# EAGLE design Macro_Watch (EAGLE 7.4.0)
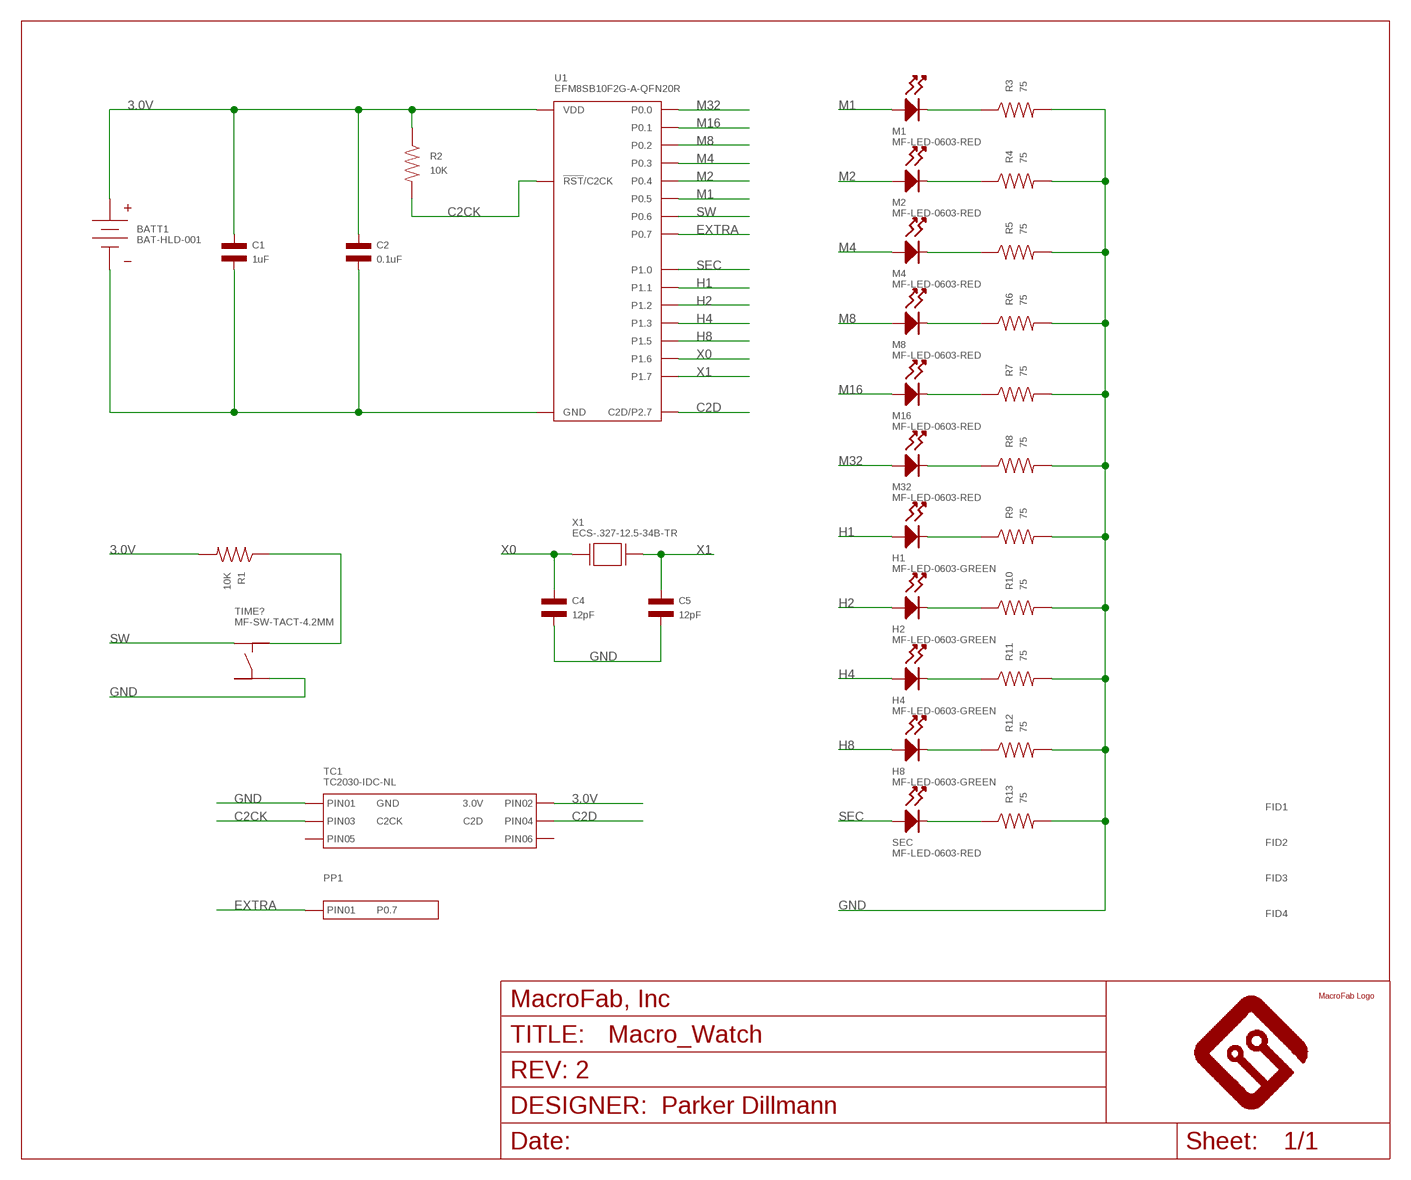
[diagram p0: schematic, sheet 1]

## Parts
BATT1  BAT-HLD-001  BATTERY_BAT-HLD-001  [BAT-HLD-001]
C1  1uF  CAPACITOR_NP_0402  [C0402]
C2  0.1uF  CAPACITOR_NP_0402  [C0402]
C4  12pF  CAPACITOR_NP_0402  [C0402]
C5  12pF  CAPACITOR_NP_0402  [C0402]
FID1  FIDUCIAL_0.5MM  [FIDUCIAL_0.5MM]
FID2  FIDUCIAL_0.5MM  [FIDUCIAL_0.5MM]
FID3  FIDUCIAL_0.5MM  [FIDUCIAL_0.5MM]
FID4  FIDUCIAL_0.5MM  [FIDUCIAL_0.5MM]
FRAME1  MF_FRAMEDEFAULT  [MF_FRAME_DEFAULT]
H1  MF-LED-0603-GREEN  LED_SINGLE-0603-GREEN  [LED0603]
H2  MF-LED-0603-GREEN  LED_SINGLE-0603-GREEN  [LED0603]
H4  MF-LED-0603-GREEN  LED_SINGLE-0603-GREEN  [LED0603]
H8  MF-LED-0603-GREEN  LED_SINGLE-0603-GREEN  [LED0603]
M1  MF-LED-0603-RED  LED_SINGLE-0603-RED  [LED0603]
M2  MF-LED-0603-RED  LED_SINGLE-0603-RED  [LED0603]
M4  MF-LED-0603-RED  LED_SINGLE-0603-RED  [LED0603]
M8  MF-LED-0603-RED  LED_SINGLE-0603-RED  [LED0603]
M16  MF-LED-0603-RED  LED_SINGLE-0603-RED  [LED0603]
M32  MF-LED-0603-RED  LED_SINGLE-0603-RED  [LED0603]
PP1  POGO_PIN_01X01_70-9150  [POGO_PIN_70-9150]
R1  10K  RESISTOR_0402  [R0402]
R2  10K  RESISTOR_0402  [R0402]
R3  75  RESISTOR_0402  [R0402]
R4  75  RESISTOR_0402  [R0402]
R5  75  RESISTOR_0402  [R0402]
R6  75  RESISTOR_0402  [R0402]
R7  75  RESISTOR_0402  [R0402]
R8  75  RESISTOR_0402  [R0402]
R9  75  RESISTOR_0402  [R0402]
R10  75  RESISTOR_0402  [R0402]
R11  75  RESISTOR_0402  [R0402]
R12  75  RESISTOR_0402  [R0402]
R13  75  RESISTOR_0402  [R0402]
SEC  MF-LED-0603-RED  LED_SINGLE-0603-RED  [LED0603]
TC1  TC2030-IDC-NL  CON_02X03_TC2030-IDC-NL  [TC2030-IDC-NL]
TIME?  MF-SW-TACT-4.2MM  TACT_4.2MM  [TACT4.2MM]
U1  EFM8SB10F2G-A-QFN20R  EFM8SB10F(2/4/8)G-A-QFN20  [EFM8SB10F(2/4/8)G-A-QFN20]
U$1  MF_LOGOLOGO_SMALL  [MF_LOGO_SMALL]
X1  ECS-.327-12.5-34B-TR  CYRSTAL_ECX-31B  [ECX-31B_SERIES]

## Nets
3.0V: BATT1.POS_0(POS) BATT1.POS_1(POS) C1.P$1 C2.P$1 R1.P$2 R2.P$1 TC1.P$2(PIN2) U1.P$4(VDD)
C2CK: R2.P$2 TC1.P$3(PIN3) U1.P$5(!RST!/C2CK)
C2D: TC1.P$4(PIN4) U1.P$6(C2D/P2.7)
EXTRA: PP1.P$1(PIN1) U1.P$15(P0.7)
GND: BATT1.NEG_0(NEG) C1.P$2 C2.P$2 C4.P$2 C5.P$2 R3.P$2 R4.P$2 R5.P$2 R6.P$2 R7.P$2 R8.P$2 R9.P$2 R10.P$2 R11.P$2 R12.P$2 R13.P$2 TC1.P$1(PIN1) TIME?.P$4 U1.P$3(GND) U1.P$12(GND) U1.PAD(GND)
H1: H1.ANODE U1.P$13(P1.1)
H2: H2.ANODE U1.P$11(P1.2)
H4: H4.ANODE U1.P$10(P1.3)
H8: H8.ANODE U1.P$9(P1.5)
M1: M1.ANODE U1.P$17(P0.5)
M2: M2.ANODE U1.P$18(P0.4)
M4: M4.ANODE U1.P$19(P0.3)
M8: M8.ANODE U1.P$20(P0.2)
M16: M16.ANODE U1.P$1(P0.1)
M32: M32.ANODE U1.P$2(P0.0)
N$1: R1.P$1 TIME?.P$2
N$6: M1.CATHODE R3.P$1
N$7: M2.CATHODE R4.P$1
N$8: M4.CATHODE R5.P$1
N$9: M8.CATHODE R6.P$1
N$10: M16.CATHODE R7.P$1
N$11: M32.CATHODE R8.P$1
N$12: H1.CATHODE R9.P$1
N$13: H2.CATHODE R10.P$1
N$14: H4.CATHODE R11.P$1
N$15: H8.CATHODE R12.P$1
N$16: R13.P$1 SEC.CATHODE
SEC: SEC.ANODE U1.P$14(P1.0)
SW: TIME?.P$1 U1.P$16(P0.6)
X0: C4.P$1 U1.P$8(P1.6) X1.P$1(X0)
X1: C5.P$1 U1.P$7(P1.7) X1.P$2(X1)
Unconnected: TC1.P$5(PIN5) TC1.P$6(PIN6) TIME?.P$3

## Library data of the parts
BATT1 = MF_Connectors:BATTERY: Library: MF_Connectors Description: Batterys and Battery Connectors.; HOUSEPART: NO; MPN: BAT-HLD-001; POPULATE: 1; URL: http://www.mouser.com/ds/2/238/bat-hld-001-220194.pdf
C1 = MF_Passives:CAPACITOR_NP: Library: MF_Passives Description: Device for Non-Polarized Capacitors. Manufacture part number (MPN) can be added via Attributes. Check https://factory.macrofab.com/parts for the house parts list.; MPN: MF-CAP-0402-1uF; POPULATE: 1
C2 = MF_Passives:CAPACITOR_NP: Library: MF_Passives Description: Device for Non-Polarized Capacitors. Manufacture part number (MPN) can be added via Attributes. Check https://factory.macrofab.com/parts for the house parts list.; MPN: MF-CAP-0402-0.1uF; POPULATE: 1
C4 C5 = MF_Passives:CAPACITOR_NP: Library: MF_Passives Description: Device for Non-Polarized Capacitors. Manufacture part number (MPN) can be added via Attributes. Check https://factory.macrofab.com/parts for the house parts list.; MPN: 500R07S120KV4T; POPULATE: 1
FID1-FID4 = MF_Aesthetics:FIDUCIAL: Library: MF_Aesthetics Description: Fiducial marking for PCB alignment inside PNP and other machines.; HOUSEPART: NO; POPULATE: 0
FRAME1 = MF_Aesthetics:MF_FRAME: Library: MF_Aesthetics Description: Frame for adding Meta Data to the PCB and Schematic.; DNAME: Parker Dillmann; HOUSEPART: 0; POPULATE: 0; REVNUM: REV: 2
H1 H2 H4 H8 = MF_LEDs:LED_SINGLE: Library: MF_LEDs Description: Device for Single LED Packages. Manufacture part number (MFG#) can be added via Attributes.; HOUSEPART: YES; MPN: MF-LED-0603-GREEN; POPULATE: 1; URL: https://factory.macrofab.com/part/MF-LED-0603-GREEN
M1 M2 M4 M8 M16 M32 SEC = MF_LEDs:LED_SINGLE: Library: MF_LEDs Description: Device for Single LED Packages. Manufacture part number (MFG#) can be added via Attributes.; HOUSEPART: YES; MPN: MF-LED-0603-RED; POPULATE: 1; URL: https://factory.macrofab.com/part/MF-LED-0603-RED
PP1 = MF_Connectors:POGO_PIN_01X01: Library: MF_Connectors Description: Pogo Pin Connector; HOUSEPART: NO; LABEL01: P0.7; POPULATE: 0; URL: http://www.avx.com/products/connectors/board-to-board/pogo-pin-single-contact-70-9150/f
R1 R2 = MF_Passives:RESISTOR: Library: MF_Passives Description: Device for Resistors. Manufacture part number (MPN), Voltage, Tolerance, and Wattage Rating can be added via Attributes. Check https://factory.macrofab.com/parts for the house parts list.; MPN: MF-RES-0402-10K; POPULATE: 1
R3-R13 = MF_Passives:RESISTOR: Library: MF_Passives Description: Device for Resistors. Manufacture part number (MPN), Voltage, Tolerance, and Wattage Rating can be added via Attributes. Check https://factory.macrofab.com/parts for the house parts list.; MPN: MF-RES-0402-75; POPULATE: 1
TC1 = MF_Connectors:CON_02X03: Library: MF_Connectors Description: Header Connector with 6 Positions and 02 Rows. Use the LABEL Attribute to label the pin on the schematic and PCB. You can remove the attributes on the PCB by using the SMASH function on the part and then deleting the text.; HOUSEPART: NO; LABEL01: GND; LABEL02: 3.0V; LABEL03: C2CK; LABEL04: C2D; MPN: TC2030-IDC-NL; POPULATE: 0; URL: http://www.tag-connect.com/TC2030-IDC-NL
TIME? = MF_Switches:TACT: Library: MF_Switches Description: Device for Tact Switches. Manufacture part number (MFG#) can be added via Attributes.; HOUSEPART: YES; MPN: MF-SW-TACT-4.2MM; POPULATE: 1; URL: https://factory.macrofab.com/part/MF-SW-TACT-4.2MM
U1 = MF_IC_Digital:EFM8SB10F(2/4/8)G-A-QFN20: Manufacturer Part #: EFM8SB10F(2/4/8)G-A-QFN20 Manufacturer: Silicon Labs Description: Sleepy Bee 8-bit Microcontrollers - MCU 8kB/512B RAM 12b ADC; HOUSEPART: NO; MPN: EFM8SB10F2G-A-QFN20R; POPULATE: 1; URL: http://www.silabs.com/products/mcu/8-bit/efm8-sleepy-bee/pages/efm8-sleepy-bee.aspx
U$1 = PP_Aesthetics:MF_LOGO
X1 = MF_Frequency_Control:CYRSTAL: Library: MF_Frequency_Control Description: Device for two functional pin Cyrstal Oscillators.; HOUSEPART: NO; MPN: ECS-.327-12.5-34B-TR; POPULATE: 1; URL: https://www.ecsxtal.com/store/pdf/ecx-31b.pdf

## Board
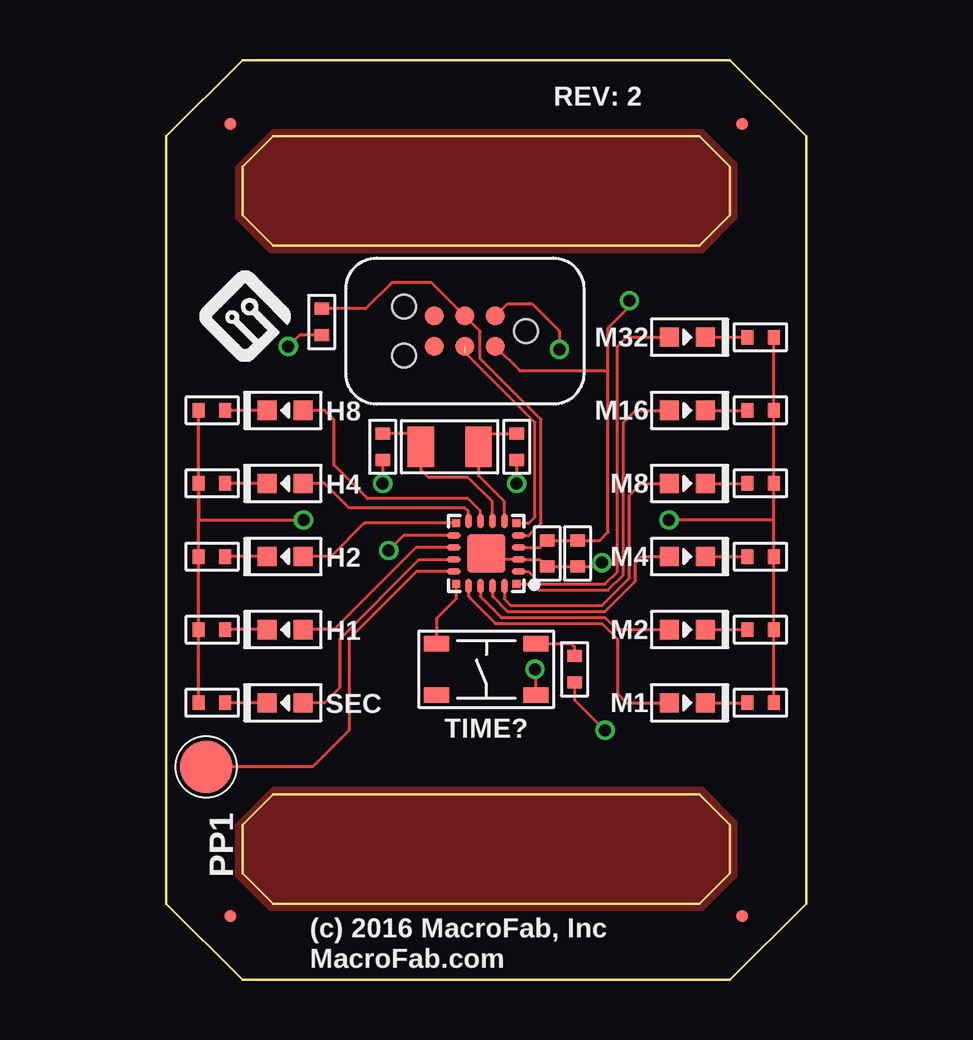
[diagram p1: board, top side]
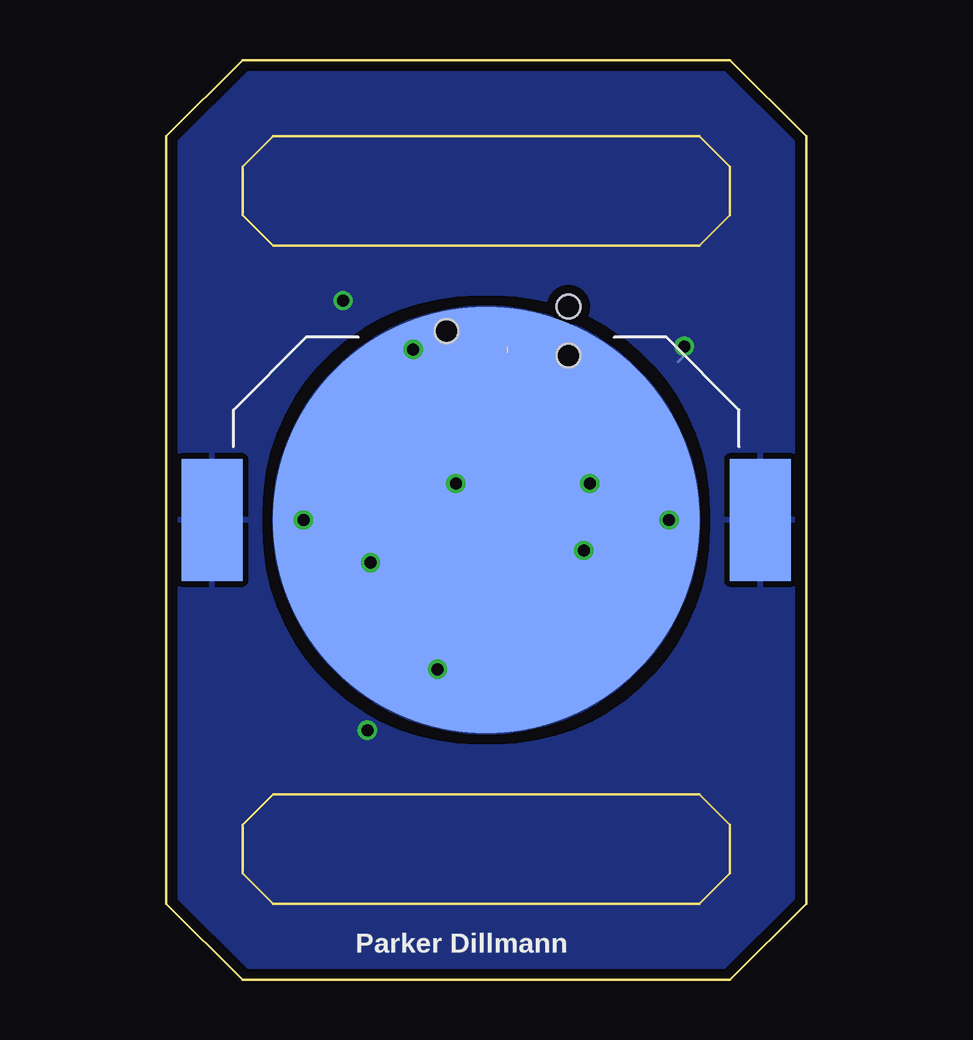
[diagram p2: board, bottom side, seen from below]

Size 26.67 x 38.35 mm. Coordinates in mm from the lower left corner, seen from the top.
Outline: 26.67,35.18 26.67,3.17 23.5,0 3.17,0 0,3.17 0,35.18 3.17,38.35 23.5,38.35 26.67,35.18
Copper layers (1*16): Top 0.035mm / dielectric 1.5mm / Bottom 0.035mm
Design rules "MF_Standard_2_Layer *": minimum track width 5mil, minimum drill 12mil, track to track 5mil, track to pad 5mil, pad to pad 5mil, via to via 5mil, smd to smd 0mil, copper to edge 10mil, drill to drill 10mil, minimum pad ring 6mil, minimum via ring 6mil, stop-mask expansion 2mil, vias tented up to drill 25mil, thermal gap 10mil
Milling: 16 lines

### Footprints (pad centres in the part's own frame; a part is rotated, then mirrored left to right if it is on the bottom)
BAT-HLD-001 = smd 17.78 x 17.78: NEG_0 0,0 | smd 2.54 x 5.08: POS_0 11.43,0; POS_1 -11.43,0
C0402 = smd 0.5 x 0.6: P$1 -0.55,0; P$2 0.55,0
FIDUCIAL_0.5MM = smd 0.5 x 0.5: FID 0,0
LED0603 = smd 0.8 x 0.8: ANODE 0.75,0; CATHODE -0.75,0
POGO_PIN_70-9150 = smd 2.2 x 2.2: P$1 0,0
R0402 = smd 0.5 x 0.6: P$1 -0.55,0; P$2 0.55,0
TC2030-IDC-NL = smd 0.787 x 0.787: P$1 -1.27,-0.635; P$2 -1.27,0.635; P$3 0,-0.635; P$4 0,0.635; P$5 1.27,-0.635; P$6 1.27,0.635 | hole 0.991: 2.54,1.016; 2.54,-1.016; -2.54,0
TACT4.2MM = smd 1.05 x 0.65: P$1 -2.075,1.075; P$2 2.075,1.075; P$3 -2.075,-1.075; P$4 2.075,-1.075
EFM8SB10F(2/4/8)G-A-QFN20 = smd 0.34 x 0.34: P$1 -1.265,1.265; P$6 -1.265,-1.265; P$11 1.265,-1.265; P$16 1.265,1.265 | smd 0.61 x 0.28: P$2 -1.355,0.75; P$3 -1.355,0.25; P$4 -1.355,-0.25; P$5 -1.355,-0.75; P$12 1.355,-0.75; P$13 1.355,-0.25; P$14 1.355,0.25; P$15 1.355,0.75 | smd 0.28 x 0.61: P$7 -0.75,-1.355; P$8 -0.25,-1.355; P$9 0.25,-1.355; P$10 0.75,-1.355; P$17 0.75,1.355; P$18 0.25,1.355; P$19 -0.25,1.355; P$20 -0.75,1.355 | smd 1.6 x 1.6: PAD 0,0
ECX-31B_SERIES = smd 1.1 x 1.7: P$1 -1.2,0; P$2 1.2,0

### Placement (x,y rotation side)
BATT1  13.34,19.18 0 bottom
C1  15.88,17.78 270 top
C2  17.14,17.78 270 top
C4  9.02,22.23 270 top
C5  14.61,22.23 270 top
FID1  2.67,2.67 0 top
FID2  2.67,35.69 0 top
FID3  24,35.69 0 top
FID4  24,2.67 0 top
FRAME1  5.97,3.05 0 top
H1  4.95,14.61 0 top
H2  4.95,17.65 0 top
H4  4.95,20.7 0 top
H8  4.95,23.75 0 top
M1  21.72,11.56 180 top
M2  21.72,14.61 180 top
M4  21.72,17.65 180 top
M8  21.72,20.7 180 top
M16  21.72,23.75 180 top
M32  21.72,26.8 180 top
PP1  1.65,8.89 270 top
R1  17.02,12.95 270 top
R2  6.48,27.43 90 top
R3  24.77,11.56 0 top
R4  24.77,14.61 0 top
R5  24.77,17.65 0 top
R6  24.77,20.7 0 top
R7  24.77,23.75 0 top
R8  24.77,26.8 0 top
R9  1.91,14.61 180 top
R10  1.91,17.65 180 top
R11  1.91,20.7 180 top
R12  1.91,23.75 180 top
R13  1.91,11.56 180 top
SEC  4.95,11.56 0 top
TC1  12.45,27.05 180 top
TIME?  13.34,12.95 0 top
U1  13.34,17.78 180 top
U$1  1.4,25.78 0 top
X1  11.81,22.23 0 top

### Tracks (layer width: path | path; a pad name or v marks a point on that pad's centre or on a via)
3.0V  (via drill 0.5)
  Top 0.127: U1.P$4 15.57,18.03 C1.P$1 C2.P$1 18.08,18.33 18.41,18.67 18.41,25.4 | R1.P$2 17.02,11.68 v18.29,10.41 | R2.P$1 5.55,26.88 v5.08,26.42 | 18.41,25.4 18.41,27.18 19.3,28.07 v19.3,28.32 | TC1.P$2 14.73,25.4 18.41,25.4
  Bottom 0.127: v18.29,10.41 18.29,10.29 | v5.08,26.42 5.08,26.04 5.33,25.78 | v19.3,28.32 19.3,28.57
  pour Bottom (isolate 0.406, rank 2): 0,38.35 26.67,38.35 26.67,1.65 26.67,0 0,0
C2CK
  Top 0.127: U1.P$5 15.1,18.53 15.62,19.05 15.62,23.37 13.08,25.91 13.08,27.05 TC1.P$3 11.05,29.08 9.4,29.08 8.3,27.98 R2.P$2
C2D  (1 unrouted)
  Top 0.127: U1.P$6 15.11,19.05 15.37,19.3 15.37,23.24 12.45,26.16
EXTRA
  Top 0.127: U1.P$15 10.43,17.03 7.62,14.22 7.62,10.41 6.1,8.89 PP1.P$1
GND  (via drill 0.5)
  Top 0.127: R13.P$2 R9.P$2 R10.P$2 R11.P$2 | R11.P$2 R12.P$2 | R3.P$2 R4.P$2 R5.P$2 | R5.P$2 R6.P$2 R7.P$2 R8.P$2 | C5.P$2 v14.61,20.7 | C4.P$2 v9.02,20.7 | v18.16,17.4 17.99,17.23 C2.P$2 C1.P$2 15.57,17.53 U1.P$3 13.59,17.53 U1.PAD | U1.P$12 9.89,18.53 v9.27,17.91 | R11.P$2 1.35,19.18 v5.71,19.18 | R5.P$2 25.32,19.18 v20.95,19.18 | TIME?.P$4 15.41,12.91 v15.37,12.95 | TC1.P$1 14.22,28.19 15.24,28.19 16.38,27.05 v16.38,26.29
  Bottom 0.127: v14.61,20.7 14.48,20.57 | v9.02,20.7 9.4,20.7 | v18.16,17.4 18.16,17.78 | v9.27,17.91 9.53,17.91 | v5.71,19.18 5.71,19.43 | v20.95,19.18 20.95,19.43 | v15.37,12.95 15.11,12.95 | v16.38,26.29 16.26,26.16 16,26.16
  pour Bottom (no thermals): 13.34,10.29 arc-90 4.45,19.18 arc-90 13.34,28.07 arc-90 22.23,19.18 arc-90
H1
  Top 0.127: U1.P$13 10.41,18.03 6.99,14.61 H1.ANODE
H2
  Top 0.127: U1.P$11 8.25,19.05 6.86,17.65 H2.ANODE
H4
  Top 0.127: U1.P$10 12.59,19.55 12.45,19.68 7.62,19.68 6.6,20.7 H4.ANODE
H8
  Top 0.127: U1.P$9 13.09,19.55 12.57,20.07 8.38,20.07 6.99,21.46 6.99,23.37 6.6,23.75 H8.ANODE
M1
  Top 0.127: U1.P$17 12.59,15.99 13.72,14.86 18.16,14.86 18.8,14.22 18.8,11.94 19.18,11.56 M1.ANODE
M2
  Top 0.127: U1.P$18 13.09,16 13.97,15.11 18.29,15.11 18.8,14.61 M2.ANODE
M4
  Top 0.127: U1.P$19 13.59,16.01 14.22,15.37 18.29,15.37 19.56,16.64 19.56,17.4 19.81,17.65 M4.ANODE
M8
  Top 0.127: U1.P$20 14.09,15.89 14.35,15.62 18.16,15.62 19.3,16.76 19.3,20.19 19.81,20.7 M8.ANODE
M16
  Top 0.127: U1.P$1 15.23,16.52 15.49,16.26 18.41,16.26 19.05,16.89 19.05,23.24 19.56,23.75 M16.ANODE
M32
  Top 0.127: U1.P$2 15.1,17.03 15.62,16.51 18.29,16.51 18.8,17.02 18.8,26.42 19.18,26.8 M32.ANODE
N$1
  Top 0.127: TIME?.P$2 16.88,14.03 17.02,13.89 R1.P$1
N$2
  pour Top: 2.92,33.91 4.45,35.43 22.35,35.43 23.75,34.04 23.75,31.75 22.35,30.35 4.32,30.35 2.92,31.75
  pour Top: 2.92,6.48 4.45,8 22.35,8 23.75,6.6 23.75,4.32 22.35,2.92 4.32,2.92 2.92,4.32
N$6
  Top 0.127: M1.CATHODE R3.P$1
N$7
  Top 0.127: M2.CATHODE R4.P$1
N$8
  Top 0.127: M4.CATHODE R5.P$1
N$9
  Top 0.127: M8.CATHODE R6.P$1
N$10
  Top 0.127: M16.CATHODE R7.P$1
N$11
  Top 0.127: M32.CATHODE R8.P$1
N$12
  Top 0.127: H1.CATHODE R9.P$1
N$13
  Top 0.127: H2.CATHODE R10.P$1
N$14
  Top 0.127: H4.CATHODE R11.P$1
N$15
  Top 0.127: H8.CATHODE R12.P$1
N$16
  Top 0.127: SEC.CATHODE R13.P$1
SEC
  Top 0.127: SEC.ANODE 6.6,11.56 7.24,12.19 7.24,14.22 10.54,17.53 U1.P$14
SW
  Top 0.127: U1.P$16 12.07,15.88 11.26,15.07 TIME?.P$1
X0
  Top 0.127: C4.P$1 10.61,22.77 X1.P$1 10.61,21.27 10.92,20.95 12.57,20.95 13.59,19.94 U1.P$8
X1
  Top 0.127: U1.P$7 14.09,19.95 13.01,21.02 X1.P$2 13.01,22.77 C5.P$1